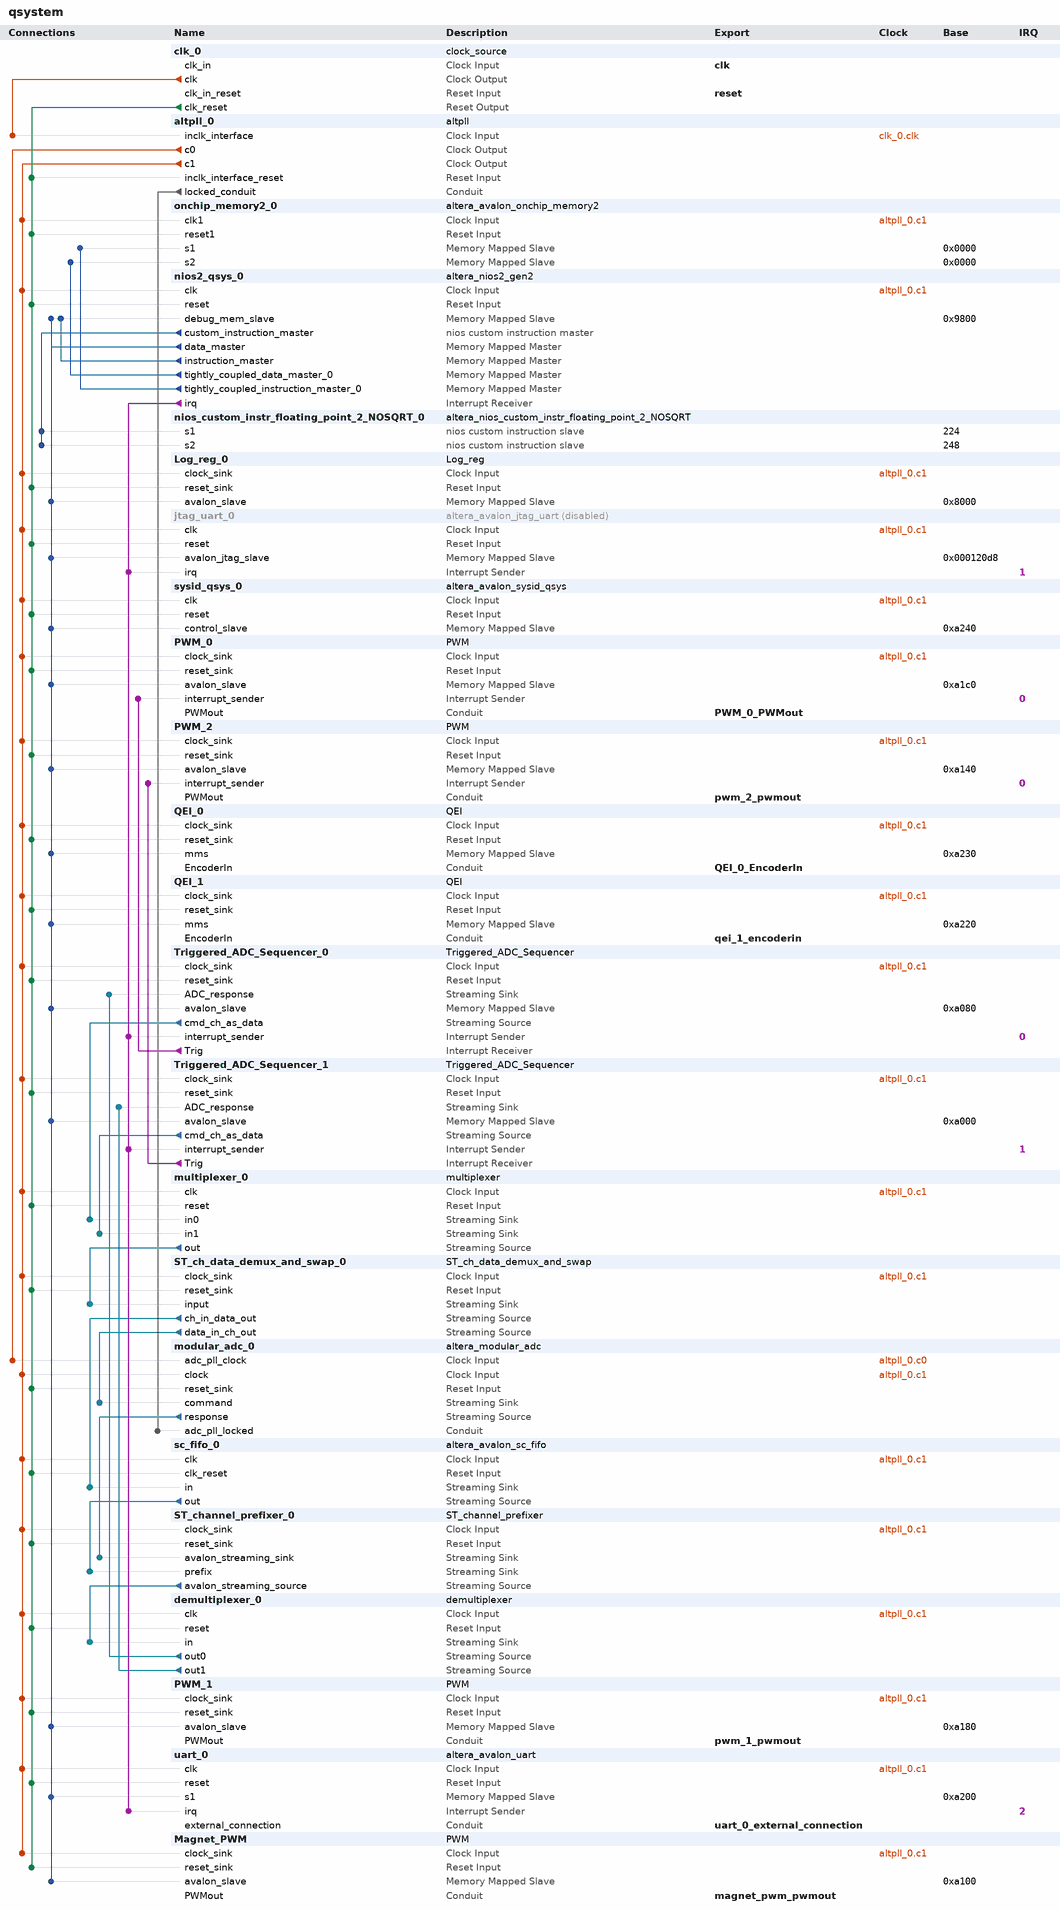
[diagram p0: system contents]
# Platform Designer (Qsys) system qsystem, MAX 10 10M08SAE144C8GES
# Parameters at their usual value, and those the tool derives, are not listed.
package require -exact qsys 15.0
create_system qsystem
set_project_property DEVICE_FAMILY {MAX 10}
set_project_property DEVICE 10M08SAE144C8GES

add_instance clk_0 clock_source 15.0
set_instance_parameter_value clk_0 clockFrequency 50000000

add_instance altpll_0 altpll 15.0
set_instance_parameter_value altpll_0 CLK0_DIVIDE_BY 5
set_instance_parameter_value altpll_0 CLK0_MULTIPLY_BY 1
set_instance_parameter_value altpll_0 CLK1_DIVIDE_BY 5
set_instance_parameter_value altpll_0 CLK1_DUTY_CYCLE 50
set_instance_parameter_value altpll_0 CLK1_MULTIPLY_BY 8
set_instance_parameter_value altpll_0 CLK1_PHASE_SHIFT 0
set_instance_parameter_value altpll_0 INCLK0_INPUT_FREQUENCY 20000
set_instance_parameter_value altpll_0 PORT_ARESET PORT_UNUSED
set_instance_parameter_value altpll_0 PORT_LOCKED PORT_UNUSED
set_instance_parameter_value altpll_0 PORT_clk1 PORT_USED
set_instance_parameter_value altpll_0 PORT_clk2 PORT_UNUSED
set_instance_parameter_value altpll_0 PORT_clk3 PORT_UNUSED

add_instance onchip_memory2_0 altera_avalon_onchip_memory2 15.0
set_instance_parameter_value onchip_memory2_0 dataWidth 32
set_instance_parameter_value onchip_memory2_0 dualPort true
set_instance_parameter_value onchip_memory2_0 initMemContent false
set_instance_parameter_value onchip_memory2_0 initializationFileName "C:\\Users\\Oskar\\Dropbox\\Servo\\FPGA\\software\\ServoDrive\\mem_init\\qsystem_onchip_memory2_0.hex"
set_instance_parameter_value onchip_memory2_0 memorySize 32768
set_instance_parameter_value onchip_memory2_0 resetrequest_enabled false
set_instance_parameter_value onchip_memory2_0 singleClockOperation true
set_instance_parameter_value onchip_memory2_0 useNonDefaultInitFile true

add_instance nios2_qsys_0 altera_nios2_gen2 15.0
set_instance_parameter_value nios2_qsys_0 dcache_numTCDM 1
set_instance_parameter_value nios2_qsys_0 dcache_size 0
set_instance_parameter_value nios2_qsys_0 exceptionSlave onchip_memory2_0.s1
set_instance_parameter_value nios2_qsys_0 icache_numTCIM 1
set_instance_parameter_value nios2_qsys_0 icache_size 0
set_instance_parameter_value nios2_qsys_0 impl Fast
set_instance_parameter_value nios2_qsys_0 mul_64_impl 1
set_instance_parameter_value nios2_qsys_0 mul_shift_choice 1
set_instance_parameter_value nios2_qsys_0 resetSlave onchip_memory2_0.s1
set_instance_parameter_value nios2_qsys_0 setting_activateTrace true

add_instance nios_custom_instr_floating_point_2_NOSQRT_0 altera_nios_custom_instr_floating_point_2_NOSQRT 15.0

add_instance Log_reg_0 Log_reg 1.0

add_instance jtag_uart_0 altera_avalon_jtag_uart 15.0
set_instance_property jtag_uart_0 ENABLED false
set_instance_parameter_value jtag_uart_0 simInteractiveOptions NO_INTERACTIVE_WINDOWS

add_instance sysid_qsys_0 altera_avalon_sysid_qsys 15.0
set_instance_parameter_value sysid_qsys_0 id 4919

add_instance PWM_0 PWM 1.0

add_instance PWM_2 PWM 1.0

add_instance QEI_0 QEI 1.0

add_instance QEI_1 QEI 1.0

add_instance Triggered_ADC_Sequencer_0 Triggered_ADC_Sequencer 1.0

add_instance Triggered_ADC_Sequencer_1 Triggered_ADC_Sequencer 1.0

add_instance multiplexer_0 multiplexer 15.0
set_instance_parameter_value multiplexer_0 bitsPerSymbol 5
set_instance_parameter_value multiplexer_0 errorWidth 0
set_instance_parameter_value multiplexer_0 numInputInterfaces 3
set_instance_parameter_value multiplexer_0 outChannelWidth 2
set_instance_parameter_value multiplexer_0 packetScheduling true
set_instance_parameter_value multiplexer_0 schedulingSize 2
set_instance_parameter_value multiplexer_0 symbolsPerBeat 1
set_instance_parameter_value multiplexer_0 useHighBitsOfChannel true
set_instance_parameter_value multiplexer_0 usePackets true

add_instance ST_ch_data_demux_and_swap_0 ST_ch_data_demux_and_swap 1.0

add_instance modular_adc_0 altera_modular_adc 15.0
set_instance_parameter_value modular_adc_0 CLOCK_FREQ 80000000
set_instance_parameter_value modular_adc_0 CORE_VAR 3
set_instance_parameter_value modular_adc_0 DEVICE_PART 10M08SAE144C8GES
set_instance_parameter_value modular_adc_0 clkdiv 2
set_instance_parameter_value modular_adc_0 external_vref 3.3
set_instance_parameter_value modular_adc_0 int_vref_vr 3.3
set_instance_parameter_value modular_adc_0 refsel 0
set_instance_parameter_value modular_adc_0 seq_order_length 1
set_instance_parameter_value modular_adc_0 seq_order_slot_1 0
set_instance_parameter_value modular_adc_0 seq_order_slot_2 30
set_instance_parameter_value modular_adc_0 seq_order_slot_3 30
set_instance_parameter_value modular_adc_0 seq_order_slot_4 30
set_instance_parameter_value modular_adc_0 seq_order_slot_5 30
set_instance_parameter_value modular_adc_0 seq_order_slot_6 30
set_instance_parameter_value modular_adc_0 seq_order_slot_7 30
set_instance_parameter_value modular_adc_0 tsclkdiv 1
set_instance_parameter_value modular_adc_0 use_ch0 true
set_instance_parameter_value modular_adc_0 use_ch2 true
set_instance_parameter_value modular_adc_0 use_ch3 true
set_instance_parameter_value modular_adc_0 use_ch4 true
set_instance_parameter_value modular_adc_0 use_ch5 true
set_instance_parameter_value modular_adc_0 use_ch6 true
set_instance_parameter_value modular_adc_0 use_ch7 true
set_instance_parameter_value modular_adc_0 use_ch8 true
set_instance_parameter_value modular_adc_0 use_tsd true

add_instance sc_fifo_0 altera_avalon_sc_fifo 15.0
set_instance_parameter_value sc_fifo_0 BITS_PER_SYMBOL 2
set_instance_parameter_value sc_fifo_0 CHANNEL_WIDTH 0
set_instance_parameter_value sc_fifo_0 ERROR_WIDTH 0
set_instance_parameter_value sc_fifo_0 FIFO_DEPTH 2
set_instance_parameter_value sc_fifo_0 USE_FILL_LEVEL 0
set_instance_parameter_value sc_fifo_0 USE_MEMORY_BLOCKS 1
set_instance_parameter_value sc_fifo_0 USE_STORE_FORWARD 0

add_instance ST_channel_prefixer_0 ST_channel_prefixer 1.0

add_instance demultiplexer_0 demultiplexer 15.0
set_instance_parameter_value demultiplexer_0 bitsPerSymbol 12
set_instance_parameter_value demultiplexer_0 errorWidth 0
set_instance_parameter_value demultiplexer_0 inChannelWidth 7
set_instance_parameter_value demultiplexer_0 numOutputInterfaces 3
set_instance_parameter_value demultiplexer_0 symbolsPerBeat 1
set_instance_parameter_value demultiplexer_0 useHighBitsOfChannel true
set_instance_parameter_value demultiplexer_0 usePackets true

add_instance PWM_1 PWM 1.0

add_instance uart_0 altera_avalon_uart 15.0
set_instance_parameter_value uart_0 baud 115200
set_instance_parameter_value uart_0 dataBits 8
set_instance_parameter_value uart_0 fixedBaud true
set_instance_parameter_value uart_0 parity NONE
set_instance_parameter_value uart_0 stopBits 1
set_instance_parameter_value uart_0 useCtsRts true

add_instance Magnet_PWM PWM 1.0

# connections
add_connection altpll_0.c0 modular_adc_0.adc_pll_clock clock
add_connection altpll_0.c1 demultiplexer_0.clk clock
add_connection altpll_0.c1 jtag_uart_0.clk clock
add_connection altpll_0.c1 Log_reg_0.clock_sink clock
add_connection altpll_0.c1 Magnet_PWM.clock_sink clock
add_connection altpll_0.c1 modular_adc_0.clock clock
add_connection altpll_0.c1 multiplexer_0.clk clock
add_connection altpll_0.c1 nios2_qsys_0.clk clock
add_connection altpll_0.c1 onchip_memory2_0.clk1 clock
add_connection altpll_0.c1 PWM_0.clock_sink clock
add_connection altpll_0.c1 PWM_1.clock_sink clock
add_connection altpll_0.c1 PWM_2.clock_sink clock
add_connection altpll_0.c1 QEI_0.clock_sink clock
add_connection altpll_0.c1 QEI_1.clock_sink clock
add_connection altpll_0.c1 sc_fifo_0.clk clock
add_connection altpll_0.c1 ST_ch_data_demux_and_swap_0.clock_sink clock
add_connection altpll_0.c1 ST_channel_prefixer_0.clock_sink clock
add_connection altpll_0.c1 sysid_qsys_0.clk clock
add_connection altpll_0.c1 Triggered_ADC_Sequencer_0.clock_sink clock
add_connection altpll_0.c1 Triggered_ADC_Sequencer_1.clock_sink clock
add_connection altpll_0.c1 uart_0.clk clock
add_connection clk_0.clk altpll_0.inclk_interface clock
add_connection clk_0.clk_reset altpll_0.inclk_interface_reset reset
add_connection clk_0.clk_reset demultiplexer_0.reset reset
add_connection clk_0.clk_reset jtag_uart_0.reset reset
add_connection clk_0.clk_reset Log_reg_0.reset_sink reset
add_connection clk_0.clk_reset Magnet_PWM.reset_sink reset
add_connection clk_0.clk_reset modular_adc_0.reset_sink reset
add_connection clk_0.clk_reset multiplexer_0.reset reset
add_connection clk_0.clk_reset nios2_qsys_0.reset reset
add_connection clk_0.clk_reset onchip_memory2_0.reset1 reset
add_connection clk_0.clk_reset PWM_0.reset_sink reset
add_connection clk_0.clk_reset PWM_1.reset_sink reset
add_connection clk_0.clk_reset PWM_2.reset_sink reset
add_connection clk_0.clk_reset QEI_0.reset_sink reset
add_connection clk_0.clk_reset QEI_1.reset_sink reset
add_connection clk_0.clk_reset sc_fifo_0.clk_reset reset
add_connection clk_0.clk_reset ST_ch_data_demux_and_swap_0.reset_sink reset
add_connection clk_0.clk_reset ST_channel_prefixer_0.reset_sink reset
add_connection clk_0.clk_reset sysid_qsys_0.reset reset
add_connection clk_0.clk_reset Triggered_ADC_Sequencer_0.reset_sink reset
add_connection clk_0.clk_reset Triggered_ADC_Sequencer_1.reset_sink reset
add_connection clk_0.clk_reset uart_0.reset reset
add_connection nios2_qsys_0.data_master jtag_uart_0.avalon_jtag_slave avalon
set_connection_parameter_value nios2_qsys_0.data_master/jtag_uart_0.avalon_jtag_slave baseAddress 0x000120d8
add_connection nios2_qsys_0.data_master Log_reg_0.avalon_slave avalon
set_connection_parameter_value nios2_qsys_0.data_master/Log_reg_0.avalon_slave baseAddress 0x8000
add_connection nios2_qsys_0.data_master Magnet_PWM.avalon_slave avalon
set_connection_parameter_value nios2_qsys_0.data_master/Magnet_PWM.avalon_slave baseAddress 0xa100
add_connection nios2_qsys_0.data_master nios2_qsys_0.debug_mem_slave avalon
set_connection_parameter_value nios2_qsys_0.data_master/nios2_qsys_0.debug_mem_slave baseAddress 0x9800
add_connection nios2_qsys_0.data_master PWM_0.avalon_slave avalon
set_connection_parameter_value nios2_qsys_0.data_master/PWM_0.avalon_slave baseAddress 0xa1c0
add_connection nios2_qsys_0.data_master PWM_1.avalon_slave avalon
set_connection_parameter_value nios2_qsys_0.data_master/PWM_1.avalon_slave baseAddress 0xa180
add_connection nios2_qsys_0.data_master PWM_2.avalon_slave avalon
set_connection_parameter_value nios2_qsys_0.data_master/PWM_2.avalon_slave baseAddress 0xa140
add_connection nios2_qsys_0.data_master QEI_0.mms avalon
set_connection_parameter_value nios2_qsys_0.data_master/QEI_0.mms baseAddress 0xa230
add_connection nios2_qsys_0.data_master QEI_1.mms avalon
set_connection_parameter_value nios2_qsys_0.data_master/QEI_1.mms baseAddress 0xa220
add_connection nios2_qsys_0.data_master sysid_qsys_0.control_slave avalon
set_connection_parameter_value nios2_qsys_0.data_master/sysid_qsys_0.control_slave baseAddress 0xa240
add_connection nios2_qsys_0.data_master Triggered_ADC_Sequencer_0.avalon_slave avalon
set_connection_parameter_value nios2_qsys_0.data_master/Triggered_ADC_Sequencer_0.avalon_slave baseAddress 0xa080
add_connection nios2_qsys_0.data_master Triggered_ADC_Sequencer_1.avalon_slave avalon
set_connection_parameter_value nios2_qsys_0.data_master/Triggered_ADC_Sequencer_1.avalon_slave baseAddress 0xa000
add_connection nios2_qsys_0.data_master uart_0.s1 avalon
set_connection_parameter_value nios2_qsys_0.data_master/uart_0.s1 baseAddress 0xa200
add_connection nios2_qsys_0.instruction_master nios2_qsys_0.debug_mem_slave avalon
set_connection_parameter_value nios2_qsys_0.instruction_master/nios2_qsys_0.debug_mem_slave baseAddress 0x9800
add_connection nios2_qsys_0.tightly_coupled_data_master_0 onchip_memory2_0.s2 avalon
set_connection_parameter_value nios2_qsys_0.tightly_coupled_data_master_0/onchip_memory2_0.s2 baseAddress 0x0000
add_connection nios2_qsys_0.tightly_coupled_instruction_master_0 onchip_memory2_0.s1 avalon
set_connection_parameter_value nios2_qsys_0.tightly_coupled_instruction_master_0/onchip_memory2_0.s1 baseAddress 0x0000
add_connection demultiplexer_0.out0 Triggered_ADC_Sequencer_0.ADC_response avalon_streaming
add_connection demultiplexer_0.out1 Triggered_ADC_Sequencer_1.ADC_response avalon_streaming
add_connection modular_adc_0.response ST_channel_prefixer_0.avalon_streaming_sink avalon_streaming
add_connection multiplexer_0.out ST_ch_data_demux_and_swap_0.input avalon_streaming
add_connection sc_fifo_0.out ST_channel_prefixer_0.prefix avalon_streaming
add_connection ST_ch_data_demux_and_swap_0.ch_in_data_out sc_fifo_0.in avalon_streaming
add_connection ST_ch_data_demux_and_swap_0.data_in_ch_out modular_adc_0.command avalon_streaming
add_connection ST_channel_prefixer_0.avalon_streaming_source demultiplexer_0.in avalon_streaming
add_connection Triggered_ADC_Sequencer_0.cmd_ch_as_data multiplexer_0.in0 avalon_streaming
add_connection Triggered_ADC_Sequencer_1.cmd_ch_as_data multiplexer_0.in1 avalon_streaming
add_connection altpll_0.locked_conduit modular_adc_0.adc_pll_locked conduit
add_connection nios2_qsys_0.irq jtag_uart_0.irq interrupt
set_connection_parameter_value nios2_qsys_0.irq/jtag_uart_0.irq irqNumber 1
add_connection nios2_qsys_0.irq Triggered_ADC_Sequencer_0.interrupt_sender interrupt
set_connection_parameter_value nios2_qsys_0.irq/Triggered_ADC_Sequencer_0.interrupt_sender irqNumber 0
add_connection nios2_qsys_0.irq Triggered_ADC_Sequencer_1.interrupt_sender interrupt
set_connection_parameter_value nios2_qsys_0.irq/Triggered_ADC_Sequencer_1.interrupt_sender irqNumber 1
add_connection nios2_qsys_0.irq uart_0.irq interrupt
set_connection_parameter_value nios2_qsys_0.irq/uart_0.irq irqNumber 2
add_connection Triggered_ADC_Sequencer_0.Trig PWM_0.interrupt_sender interrupt
set_connection_parameter_value Triggered_ADC_Sequencer_0.Trig/PWM_0.interrupt_sender irqNumber 0
add_connection Triggered_ADC_Sequencer_1.Trig PWM_2.interrupt_sender interrupt
set_connection_parameter_value Triggered_ADC_Sequencer_1.Trig/PWM_2.interrupt_sender irqNumber 0
add_connection nios2_qsys_0.custom_instruction_master nios_custom_instr_floating_point_2_NOSQRT_0.s1 nios_custom_instruction
set_connection_parameter_value nios2_qsys_0.custom_instruction_master/nios_custom_instr_floating_point_2_NOSQRT_0.s1 CIName nios_custom_instr_floating_point_2_nosqrt_0
set_connection_parameter_value nios2_qsys_0.custom_instruction_master/nios_custom_instr_floating_point_2_NOSQRT_0.s1 baseAddress 224
add_connection nios2_qsys_0.custom_instruction_master nios_custom_instr_floating_point_2_NOSQRT_0.s2 nios_custom_instruction
set_connection_parameter_value nios2_qsys_0.custom_instruction_master/nios_custom_instr_floating_point_2_NOSQRT_0.s2 CIName nios_custom_instr_floating_point_2_nosqrt_0_1
set_connection_parameter_value nios2_qsys_0.custom_instruction_master/nios_custom_instr_floating_point_2_NOSQRT_0.s2 baseAddress 248

# exported interfaces
add_interface PWM_0_PWMout conduit end
set_interface_property PWM_0_PWMout EXPORT_OF PWM_0.PWMout
add_interface QEI_0_EncoderIn conduit end
set_interface_property QEI_0_EncoderIn EXPORT_OF QEI_0.EncoderIn
add_interface clk clock sink
set_interface_property clk EXPORT_OF clk_0.clk_in
add_interface magnet_pwm_pwmout conduit end
set_interface_property magnet_pwm_pwmout EXPORT_OF Magnet_PWM.PWMout
add_interface pwm_1_pwmout conduit end
set_interface_property pwm_1_pwmout EXPORT_OF PWM_1.PWMout
add_interface pwm_2_pwmout conduit end
set_interface_property pwm_2_pwmout EXPORT_OF PWM_2.PWMout
add_interface qei_1_encoderin conduit end
set_interface_property qei_1_encoderin EXPORT_OF QEI_1.EncoderIn
add_interface reset reset sink
set_interface_property reset EXPORT_OF clk_0.clk_in_reset
add_interface uart_0_external_connection conduit end
set_interface_property uart_0_external_connection EXPORT_OF uart_0.external_connection

set_interconnect_requirement {$system} qsys_mm.clockCrossingAdapter HANDSHAKE
set_interconnect_requirement {$system} qsys_mm.insertDefaultSlave false
set_interconnect_requirement {$system} qsys_mm.maxAdditionalLatency 1

save_system qsystem.qsys
